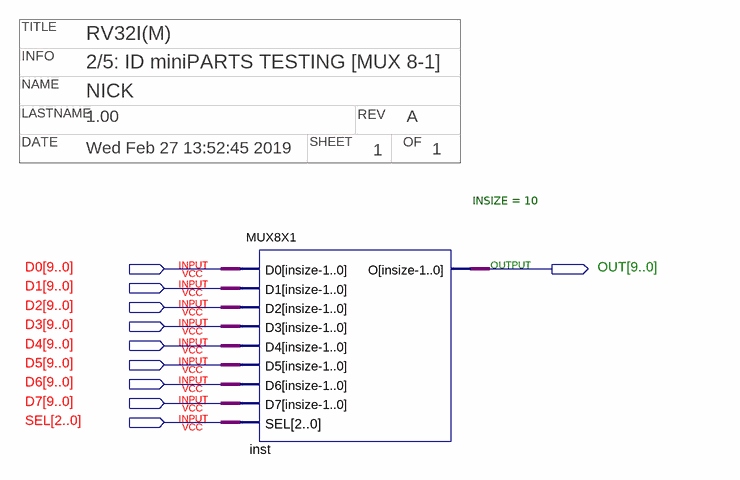
[diagram p0: schematic sheet]
// Quartus schematic MUX8X1TEST.bdf as structural Verilog: 1 symbols, 10 pins
// Title block: TITLE: RV32I(M); INFO: 2/5: ID miniPARTS TESTING [MUX 8-1]; NAME: NICK; LASTNAME: 1.00; REV: A; DATE: Wed Feb 27 13:52:45 2019; SHEET: 1; OF: 1
module MUX8X1TEST (
  input  [9:0] D0,
  input  [9:0] D1,
  input  [9:0] D2,
  input  [9:0] D3,
  input  [9:0] D4,
  input  [9:0] D5,
  input  [9:0] D6,
  input  [9:0] D7,
  input  [2:0] SEL,
  output [9:0] OUT
);

  MUX8X1 #(.INSIZE(10)) inst (
    .D0(D0), .D1(D1), .D2(D2), .D3(D3), .D4(D4), .D5(D5), .D6(D6), .D7(D7), .SEL(SEL), .O(OUT));
endmodule
